# EAGLE schematic Vehicle Tractive System (EAGLE 9.6.2)
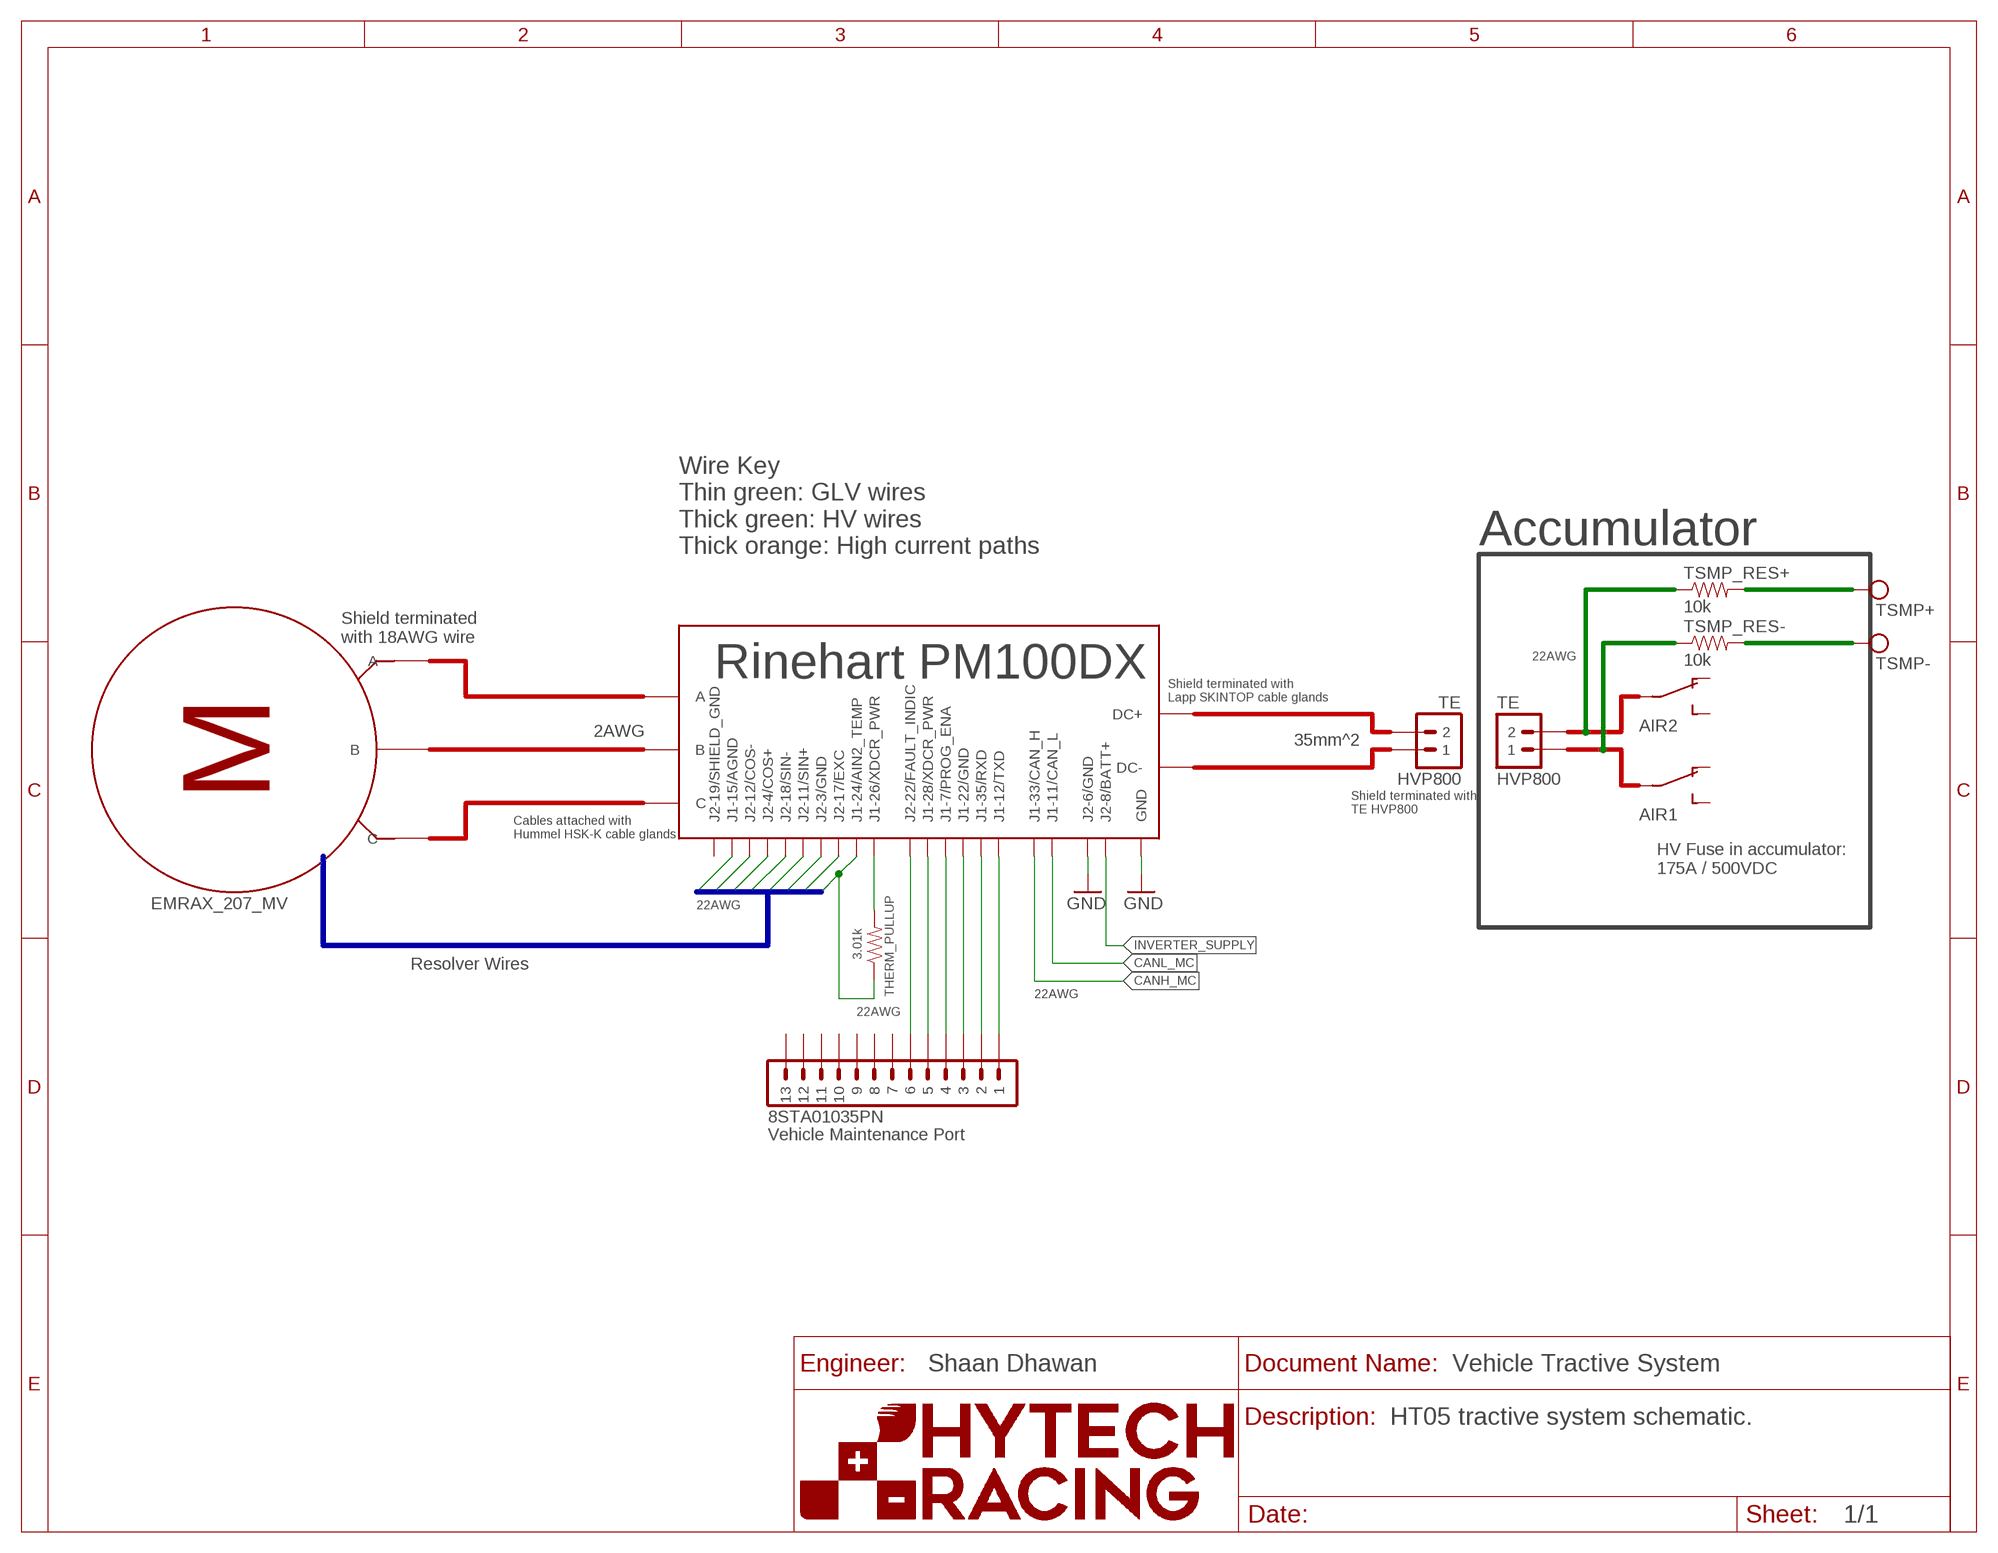
[diagram p0: schematic, sheet 1]
U$1 (FRAME_A_L): ORIENTATION: LANDSCAPE; SIZE: A

## Parts
8STA01035PN  Vehicle Maintenance Port  M13  (no package)
AIR1  SWITCH_SPST  (no package)
AIR2  SWITCH_SPST  (no package)
EMRAX_207_MV  MOTOR_AC  (no package)
MAIN  HVP800  M02  (no package)
TE  HVP800  M02  (no package)
THERM_PULLUP  3.01k  RESISTORPTH-1/4W  [AXIAL-0.4]
TSMP+  +  TEST_POINT  [TEST_POINT]
TSMP_RES+  10k  RESISTOR10W  [10W_RESISTOR_VISHAY]
TSMP_RES-  10k  RESISTOR10W  [10W_RESISTOR_VISHAY]
U$2  RINEHART_PM100DX  (no package)
U$4  TEST_POINT  [TEST_POINT]

## Nets
AGND: U$2.J1-15/AGND
AIN2_TEMP: THERM_PULLUP.P$1 U$2.J1-24/AIN2_TEMP
CANH_MC: U$2.J1-33/CAN_H
CANL_MC: U$2.J1-11/CAN_L
COS+: U$2.J2-4/COS+
COS-: U$2.J2-12/COS-
EXC: U$2.J2-17/EXC
GND: U$2.GND U$2.J2-3/GND U$2.J2-6/GND
INVERTER_SUPPLY: U$2.J2-8/BATT+
N$1: 8STA01035PN.1 U$2.J1-12/TXD
N$2: 8STA01035PN.2 U$2.J1-35/RXD
N$3: 8STA01035PN.3 U$2.J1-22/GND
N$4: 8STA01035PN.4 U$2.J1-7/PROG_ENA
N$5: 8STA01035PN.5 U$2.J1-28/XDCR_PWR
N$6: 8STA01035PN.6 U$2.J2-22/FAULT_INDIC
N$7: TSMP_RES-.1
N$8: TSMP_RES+.1
N$9: TSMP+.P$1 TSMP_RES+.2
N$10: TSMP_RES-.2 U$4.P$1
N$11: THERM_PULLUP.P$2 U$2.J1-26/XDCR_PWR
SIN+: U$2.J2-11/SIN+
SIN-: U$2.J2-18/SIN-
Unconnected: 8STA01035PN.7 8STA01035PN.8 8STA01035PN.9 8STA01035PN.10 8STA01035PN.11 8STA01035PN.12 8STA01035PN.13 AIR1.O AIR1.P AIR1.S AIR2.O AIR2.P AIR2.S EMRAX_207_MV.A EMRAX_207_MV.B EMRAX_207_MV.C MAIN.1 MAIN.2 TE.1 TE.2 U$2.A U$2.B U$2.C U$2.DC+ U$2.DC- U$2.J2-19/SHIELD_GND

## Buses
RESOLVERWIRES:AGND,AIN2_TEMP,COS+,COS-,EXC,GND,SIN-,SIN+,XDCR_PWR

## Notes on the sheet
- Accumulator
- Wire Key
  Thin green: GLV wires
  Thick green: HV wires
  Thick orange: High current paths
- TSMP+
- Shield terminated
  with 18AWG wire
- 22AWG
- TSMP-
- Shield terminated with
  Lapp SKINTOP cable glands
- TE
- 2AWG
- 35mm^2
- Shield terminated with
  TE HVP800
- Cables attached with
  Hummel HSK-K cable glands
- HV Fuse in accumulator:
  175A / 500VDC
- 22AWG
- Resolver Wires
- 22AWG
- 22AWG
- Shaan Dhawan
- HT05 tractive system schematic.

## Library data of the parts
8STA01035PN = HyTechSymbols:M13: Generic 13-pin connector
AIR1 AIR2 = HyTechSymbols:SWITCH_SPST: Single Pull Single Throw Switch
EMRAX_207_MV = HyTechSymbols:MOTOR_AC: Generic three-phase AC electric motor
MAIN TE = HyTechSymbols:M02: Generic 2-pin connector
THERM_PULLUP TSMP_RES+ TSMP_RES- = HyTechDevices:RESISTOR: Resistor Basic schematic elements and footprints for 0603, 1206, and PTH resistors.
TSMP+ U$4 = HyTechDevices:TEST_POINT: Keystone Electronics Test Point 5005
U$2 = HyTechSymbols:RINEHART_PM100DX: Rinehart Motion Systems PM100DX Motor Inverter Product Page <http://www.rinehartmotion.com/standard.html> Datasheet <http://www.rinehartmotion.com/uploads/5/1/3/0/51309945/pm100-150datasheet_2.pdf>